# Altium project FPGA Interface Board.PrjPcb
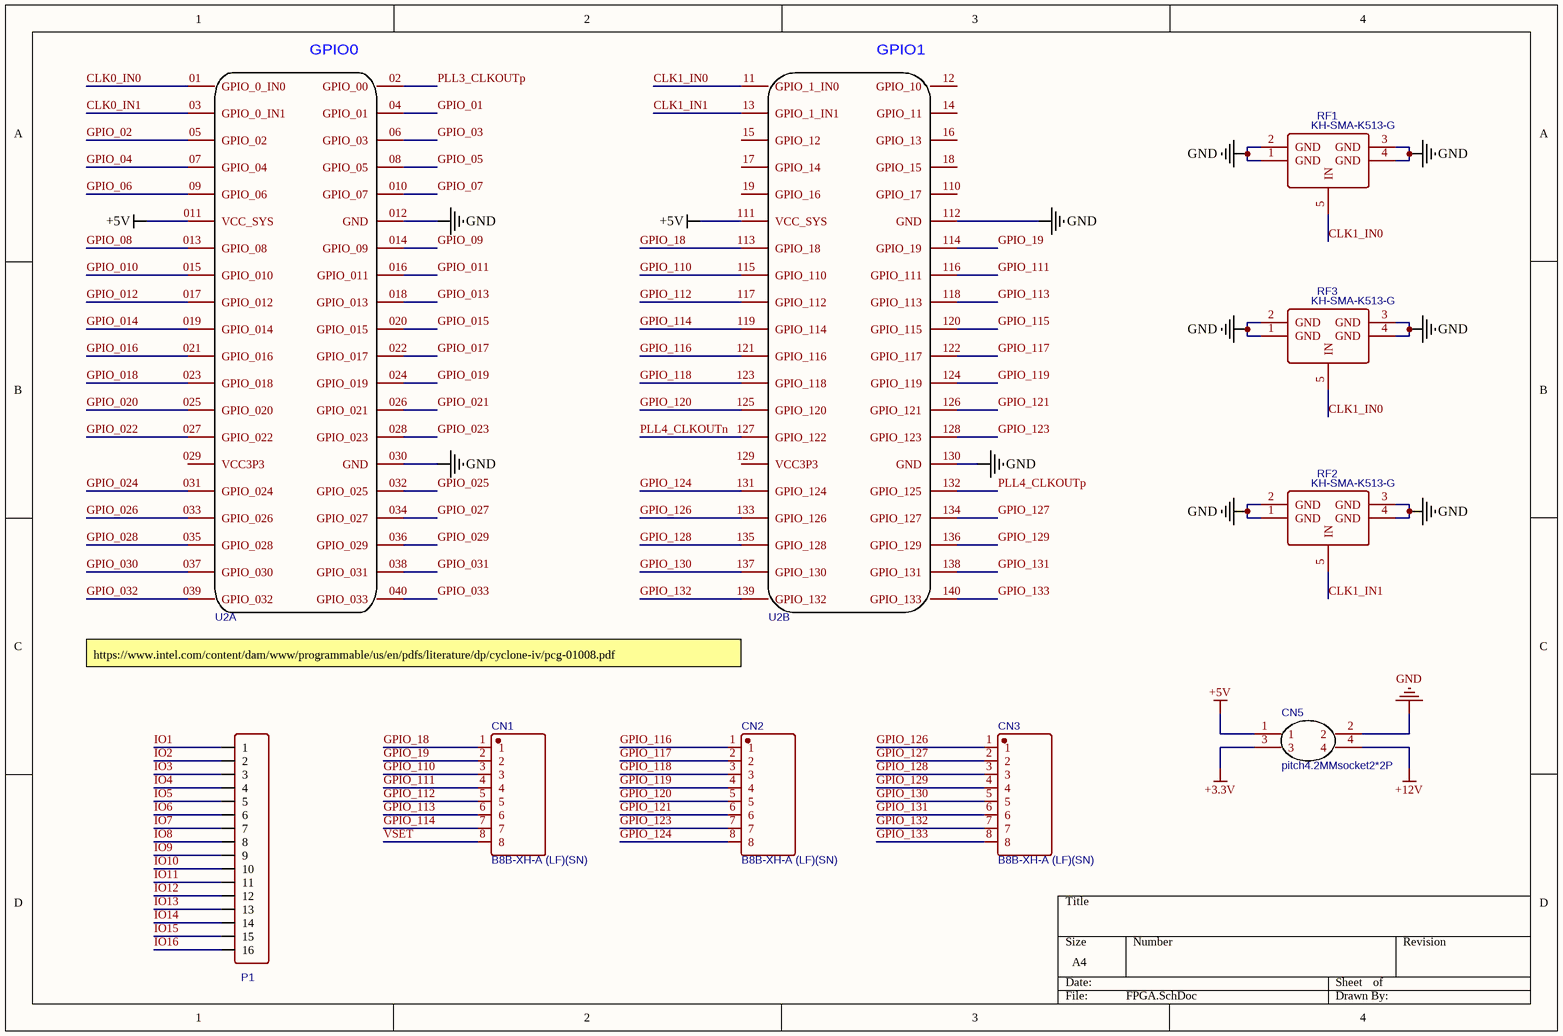
[diagram p0: FPGA.SchDoc]
5 sheets, 216 parts. Net scope: global (net labels, ports and power ports of the same name join across sheets).
Board file: PCB1.PcbDoc
Sheets:
  FPGA.SchDoc
  Shift Registers.SchDoc
  Level Translators.SchDoc
  Logic Voltage Source.SchDoc
  Level Translateor switches.SchDoc

## Sheet FPGA.SchDoc
size A4

### Parts
CN1  B8B-XH-A (LF)(SN)  [CONN-TH_B8B-XH-A (LF)(SN)]
CN2  B8B-XH-A (LF)(SN)  [CONN-TH_B8B-XH-A (LF)(SN)]
CN3  B8B-XH-A (LF)(SN)  [CONN-TH_B8B-XH-A (LF)(SN)]
CN5  pitch4.2MMsocket2*2P  [CONN-TH_HAA420A-4A]
P1  Header-Female-2.54_1x16  [HDR-TH_16P-P2.54-V]  (value not drawn)
RF1  KH-SMA-K513-G  [ANT-TH_KH-SMA-K513-G]
RF2  KH-SMA-K513-G  [ANT-TH_KH-SMA-K513-G]
RF3  KH-SMA-K513-G  [ANT-TH_KH-SMA-K513-G]
U2  DE0 NANO UPSIDE-DOWN PIN HEADERS COPY  [DE0-NANO UPSIDE DOWN]  (value not drawn)  (parts A,B of 2)

### Nets
+3.3V: CN5.3
+5V: CN5.1 U2.011(VCC_SYS) U2.111(VCC_SYS)
+12V: CN5.4
GND: CN5.2 RF1.1(GND) RF1.2(GND) RF1.3(GND) RF1.4(GND) RF2.1(GND) RF2.2(GND) RF2.3(GND) RF2.4(GND) RF3.1(GND) RF3.2(GND) RF3.3(GND) RF3.4(GND) U2.012(GND) U2.030(GND) U2.112(GND) U2.130(GND)
CLK0_IN0: U2.01(GPIO_0_IN0)
CLK0_IN1: U2.03(GPIO_0_IN1)
CLK1_IN0: RF1.5(IN) RF3.5(IN) U2.11(GPIO_1_IN0)
CLK1_IN1: RF2.5(IN) U2.13(GPIO_1_IN1)
GPIO_01: U2.04(GPIO_01)
GPIO_02: U2.05(GPIO_02)
GPIO_03: U2.06(GPIO_03)
GPIO_04: U2.07(GPIO_04)
GPIO_05: U2.08(GPIO_05)
GPIO_06: U2.09(GPIO_06)
GPIO_07: U2.010(GPIO_07)
GPIO_08: U2.013(GPIO_08)
GPIO_09: U2.014(GPIO_09)
GPIO_010: U2.015(GPIO_010)
GPIO_011: U2.016(GPIO_011)
GPIO_012: U2.017(GPIO_012)
GPIO_013: U2.018(GPIO_013)
GPIO_014: U2.019(GPIO_014)
GPIO_015: U2.020(GPIO_015)
GPIO_016: U2.021(GPIO_016)
GPIO_017: U2.022(GPIO_017)
GPIO_018: U2.023(GPIO_018)
GPIO_18: CN1.1 U2.113(GPIO_18)
GPIO_019: U2.024(GPIO_019)
GPIO_19: CN1.2 U2.114(GPIO_19)
GPIO_020: U2.025(GPIO_020)
GPIO_021: U2.026(GPIO_021)
GPIO_022: U2.027(GPIO_022)
GPIO_023: U2.028(GPIO_023)
GPIO_024: U2.031(GPIO_024)
GPIO_025: U2.032(GPIO_025)
GPIO_026: U2.033(GPIO_026)
GPIO_027: U2.034(GPIO_027)
GPIO_028: U2.035(GPIO_028)
GPIO_029: U2.036(GPIO_029)
GPIO_030: U2.037(GPIO_030)
GPIO_031: U2.038(GPIO_031)
GPIO_032: U2.039(GPIO_032)
GPIO_033: U2.040(GPIO_033)
GPIO_110: CN1.3 U2.115(GPIO_110)
GPIO_111: CN1.4 U2.116(GPIO_111)
GPIO_112: CN1.5 U2.117(GPIO_112)
GPIO_113: CN1.6 U2.118(GPIO_113)
GPIO_114: CN1.7 U2.119(GPIO_114)
GPIO_115: U2.120(GPIO_115)
GPIO_116: CN2.1 U2.121(GPIO_116)
GPIO_117: CN2.2 U2.122(GPIO_117)
GPIO_118: CN2.3 U2.123(GPIO_118)
GPIO_119: CN2.4 U2.124(GPIO_119)
GPIO_120: CN2.5 U2.125(GPIO_120)
GPIO_121: CN2.6 U2.126(GPIO_121)
GPIO_123: CN2.7 U2.128(GPIO_123)
GPIO_124: CN2.8 U2.131(GPIO_124)
GPIO_126: CN3.1 U2.133(GPIO_126)
GPIO_127: CN3.2 U2.134(GPIO_127)
GPIO_128: CN3.3 U2.135(GPIO_128)
GPIO_129: CN3.4 U2.136(GPIO_129)
GPIO_130: CN3.5 U2.137(GPIO_130)
GPIO_131: CN3.6 U2.138(GPIO_131)
GPIO_132: CN3.7 U2.139(GPIO_132)
GPIO_133: CN3.8 U2.140(GPIO_133)
IO1: P1.1
IO2: P1.2
IO3: P1.3
IO4: P1.4
IO5: P1.5
IO6: P1.6
IO7: P1.7
IO8: P1.8
IO9: P1.9
IO10: P1.10
IO11: P1.11
IO12: P1.12
IO13: P1.13
IO14: P1.14
IO15: P1.15
IO16: P1.16
PLL3_CLKOUTp: U2.02(GPIO_00)
PLL4_CLKOUTn: U2.127(GPIO_122)
PLL4_CLKOUTp: U2.132(GPIO_125)
VSET: CN1.8

Not connected (* = marked no-connect by the designer): U2 12(GPIO_10) 14(GPIO_11) 15(GPIO_12) 16(GPIO_13) 17(GPIO_14) 18(GPIO_15) 19(GPIO_16) 029(VCC3P3) 110(GPIO_17) 129(VCC3P3)

### Notes on the sheet
- (near U2) https://www.intel.com/content/dam/www/programmable/us/en/pdfs/literature/dp/cyclone-iv/pcg-01008.pdf
- (in symbol DE0 NANO UPSIDE-DOWN PIN HEADERS COPY, part A) GPIO0
- (in symbol DE0 NANO UPSIDE-DOWN PIN HEADERS COPY, part B) GPIO1

### Library data of the parts
CN1-CN3 = B8B-XH-A (LF)(SN): Manufacturer: JST Sales America; Contributor: LCSC; spicePre: C; spiceSymbolName: B8B-XH-A (LF)(SN); Supplier: LCSC; Supplier Part Number: C157972; Manufacture Part Number: B8B-XH-A (LF)(SN)
CN5 = pitch4.2MMsocket2*2P: Manufacturer: BOOMELE; image: //image.lceda.cn/szlcsc/C24697.jpg; spicePre: C; spiceSymbolName: pitch4.2MMsocket2*2P; Supplier: LCSC; Manufacture Part Number: pitch4.2MMsocket2*2P; Supplier Part Number: C24697
P1 = Header-Female-2.54_1x16: Manufacturer: BOOMELE; Manufacture Part Number: Female header1*16P pitch 2.54mm; image: //image.lceda.cn/szlcsc/C66987.jpg; spicePre: P; spiceSymbolName: Header-Female-2.54_1x16; Supplier: LCSC; Supplier Part Number: C66987
RF1-RF3 = KH-SMA-K513-G: Manufacturer: Shenzhen Kinghelm Elec; Contributor: LCSC; spicePre: R; spiceSymbolName: KH-SMA-K513-G; Supplier: LCSC; Supplier Part Number: C411575; Manufacture Part Number: KH-SMA-K513-G
U2 = DE0 NANO UPSIDE-DOWN PIN HEADERS COPY: subpart_no: 1; Contributor: cemasoniv; spicePre: U; spiceSymbolName: DE0 NANO UPSIDE-DOWN PIN HEADERS COPY

## Sheet Shift Registers.SchDoc
size A4
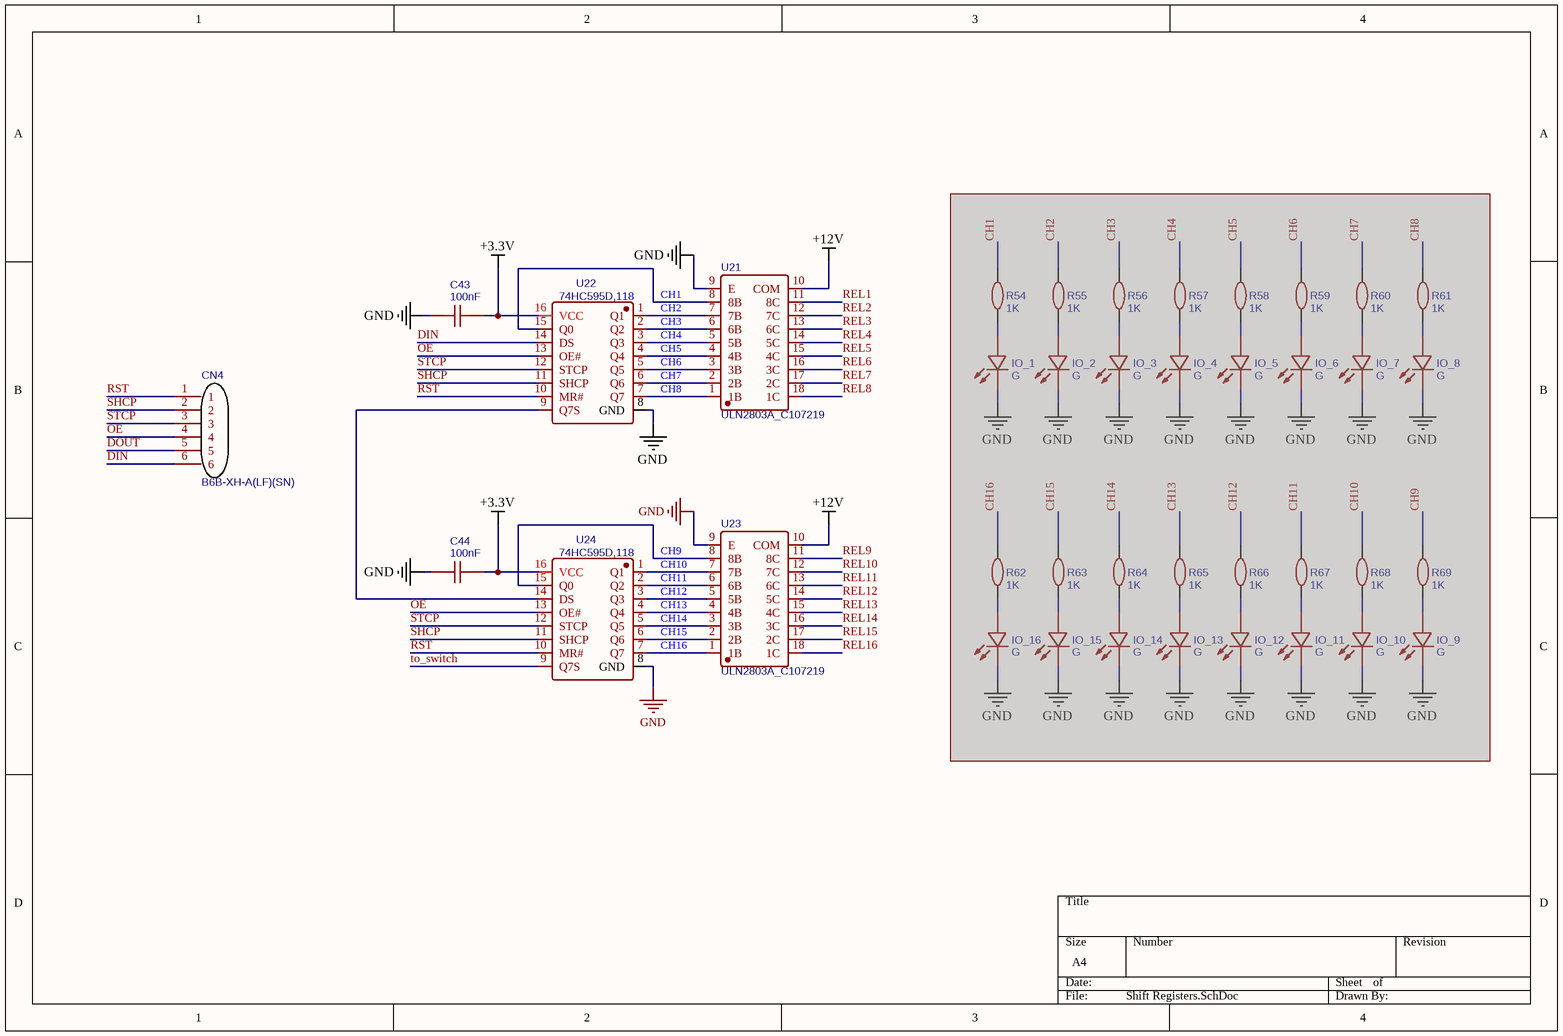
[diagram p1: Shift Registers.SchDoc]

### Parts
(Parts that share a designator on the sheet are numbered #1, #2 ... from top to bottom, then left to right.)
C43  100nF  [C0603]
C44  100nF  [C0603]
CN4  B6B-XH-A(LF)(SN)  [CONN-TH_6P-P2.50_B6B-XH-A(LF)(SN)]
IO_1  G  [LED0603-R-RD]  (masked out: inside a compile mask, not in the netlist)
IO_2  G  [LED0603-R-RD]  (masked out: inside a compile mask, not in the netlist)
IO_3  G  [LED0603-R-RD]  (masked out: inside a compile mask, not in the netlist)
IO_4  G  [LED0603-R-RD]  (masked out: inside a compile mask, not in the netlist)
IO_5  G  [LED0603-R-RD]  (masked out: inside a compile mask, not in the netlist)
IO_6  G  [LED0603-R-RD]  (masked out: inside a compile mask, not in the netlist)
IO_7  G  [LED0603-R-RD]  (masked out: inside a compile mask, not in the netlist)
IO_8  G  [LED0603-R-RD]  (masked out: inside a compile mask, not in the netlist)
IO_9  G  [LED0603-R-RD]  (masked out: inside a compile mask, not in the netlist)
IO_10  G  [LED0603-R-RD]  (masked out: inside a compile mask, not in the netlist)
IO_11  G  [LED0603-R-RD]  (masked out: inside a compile mask, not in the netlist)
IO_12  G  [LED0603-R-RD]  (masked out: inside a compile mask, not in the netlist)
IO_13  G  [LED0603-R-RD]  (masked out: inside a compile mask, not in the netlist)
IO_14  G  [LED0603-R-RD]  (masked out: inside a compile mask, not in the netlist)
IO_15  G  [LED0603-R-RD]  (masked out: inside a compile mask, not in the netlist)
IO_16  G  [LED0603-R-RD]  (masked out: inside a compile mask, not in the netlist)
R54#1  1K  [R0603]  (masked out: inside a compile mask, not in the netlist)
R55#1  1K  [R0603]  (masked out: inside a compile mask, not in the netlist)
R56#1  1K  [R0603]  (masked out: inside a compile mask, not in the netlist)
R57#1  1K  [R0603]  (masked out: inside a compile mask, not in the netlist)
R58#1  1K  [R0603]  (masked out: inside a compile mask, not in the netlist)
R59#1  1K  [R0603]  (masked out: inside a compile mask, not in the netlist)
R60#1  1K  [R0603]  (masked out: inside a compile mask, not in the netlist)
R61#1  1K  [R0603]  (masked out: inside a compile mask, not in the netlist)
R62#1  1K  [R0603]  (masked out: inside a compile mask, not in the netlist)
R63#1  1K  [R0603]  (masked out: inside a compile mask, not in the netlist)
R64#1  1K  [R0603]  (masked out: inside a compile mask, not in the netlist)
R65#1  1K  [R0603]  (masked out: inside a compile mask, not in the netlist)
R66#1  1K  [R0603]  (masked out: inside a compile mask, not in the netlist)
R67#1  1K  [R0603]  (masked out: inside a compile mask, not in the netlist)
R68#1  1K  [R0603]  (masked out: inside a compile mask, not in the netlist)
R69#1  1K  [R0603]  (masked out: inside a compile mask, not in the netlist)
U21  ULN2803A_C107219  [SOP-18_L11.4-W7.6-P1.27-LS10.6-BL]
U22  74HC595D,118  [SOIC-16_L9.9-W3.9-P1.27-LS6.0-BL]
U23  ULN2803A_C107219  [SOP-18_L11.4-W7.6-P1.27-LS10.6-BL]
U24  74HC595D,118  [SOIC-16_L9.9-W3.9-P1.27-LS6.0-BL]

### Nets
+3.3V: C43.2 C44.2 U22.16(VCC) U24.16(VCC)
+12V: U21.10(COM) U23.10(COM)
GND: C43.1 C44.1 U21.9(E) U22.8(GND) U23.9(E) U24.8(GND)
CH1: U21.8(8B) U22.15(Q0)
CH2: U21.7(7B) U22.1(Q1)
CH3: U21.6(6B) U22.2(Q2)
CH4: U21.5(5B) U22.3(Q3)
CH5: U21.4(4B) U22.4(Q4)
CH6: U21.3(3B) U22.5(Q5)
CH7: U21.2(2B) U22.6(Q6)
CH8: U21.1(1B) U22.7(Q7)
CH9: U23.8(8B) U24.15(Q0)
CH10: U23.7(7B) U24.1(Q1)
CH11: U23.6(6B) U24.2(Q2)
CH12: U23.5(5B) U24.3(Q3)
CH13: U23.4(4B) U24.4(Q4)
CH14: U23.3(3B) U24.5(Q5)
CH15: U23.2(2B) U24.6(Q6)
CH16: U23.1(1B) U24.7(Q7)
DIN: CN4.6 U22.14(DS)
DOUT: CN4.5
OE: CN4.4 U22.13(OE#) U24.13(OE#)
REL1: U21.11(8C)
REL2: U21.12(7C)
REL3: U21.13(6C)
REL4: U21.14(5C)
REL5: U21.15(4C)
REL6: U21.16(3C)
REL7: U21.17(2C)
REL8: U21.18(1C)
REL9: U23.11(8C)
REL10: U23.12(7C)
REL11: U23.13(6C)
REL12: U23.14(5C)
REL13: U23.15(4C)
REL14: U23.16(3C)
REL15: U23.17(2C)
REL16: U23.18(1C)
RST: CN4.1 U22.10(MR#) U24.10(MR#)
SHCP: CN4.2 U22.11(SHCP) U24.11(SHCP)
STCP: CN4.3 U22.12(STCP) U24.12(STCP)
to_switch: U24.9(Q7S)
NetU22_9: U22.9(Q7S) U24.14(DS)

### Library data of the parts
C43 C44 = 100nF: Manufacturer: YAGEO; Manufacture Part Number: CC0603KRX7R9BB104; nameAlias: Capacitance; SMT Type: Basic; BOM_LCSC Assembly: Yes; spicePre: C; spiceSymbolName: CC0603KRX7R9BB104; Supplier: LCSC; Supplier Part Number: C14663
CN4 = B6B-XH-A(LF)(SN): Manufacturer: JST Sales America; Contributor: LCSC; spicePre: U; spiceSymbolName: B6B-XH-A(LF)(SN); Supplier: LCSC; Supplier Part Number: C144397; Manufacture Part Number: B6B-XH-A(LF)(SN)
IO_1-IO_16 = G: Manufacturer: Orient; Manufacture Part Number: ORH-G36G; Contributor: LCSC; SMT Type: Extend; BOM_LCSC Assembly: Yes; spicePre: L; spiceSymbolName: ORH-G36G; Supplier: LCSC; Supplier Part Number: C205443
R54#1 R55#1 R56#1 R57#1 R58#1 R59#1 R60#1 R61#1 R62#1 R63#1 R64#1 R65#1 R66#1 R67#1 R68#1 R69#1 = 1K: Manufacture Part Number: RC0603FR-071KL; Manufacturer: YAGEO; nameAlias: Resistance (Ohms); spicePre: R; spiceSymbolName: RC0603FR-071KL; Supplier: LCSC; Supplier Part Number: C22548
U21 U23 = ULN2803A_C107219: Manufacturer: MIXIC; SMT Type: Extend; BOM_LCSC Assembly: Yes; spicePre: U; spiceSymbolName: ULN2803A_C107219; Supplier: LCSC; Manufacture Part Number: ULN2803A; Supplier Part Number: C107219
U22 U24 = 74HC595D,118: Manufacturer: Nexperia; SMT Type: Basic; spicePre: X; BOM_LCSC Assembly: Yes; image: //image.lceda.cn/szlcsc/C5947.jpg; spiceSymbolName: 74HC595D,118; Supplier: LCSC; Manufacture Part Number: 74HC595D,118; Supplier Part Number: C5947

## Sheet Level Translators.SchDoc
size A2
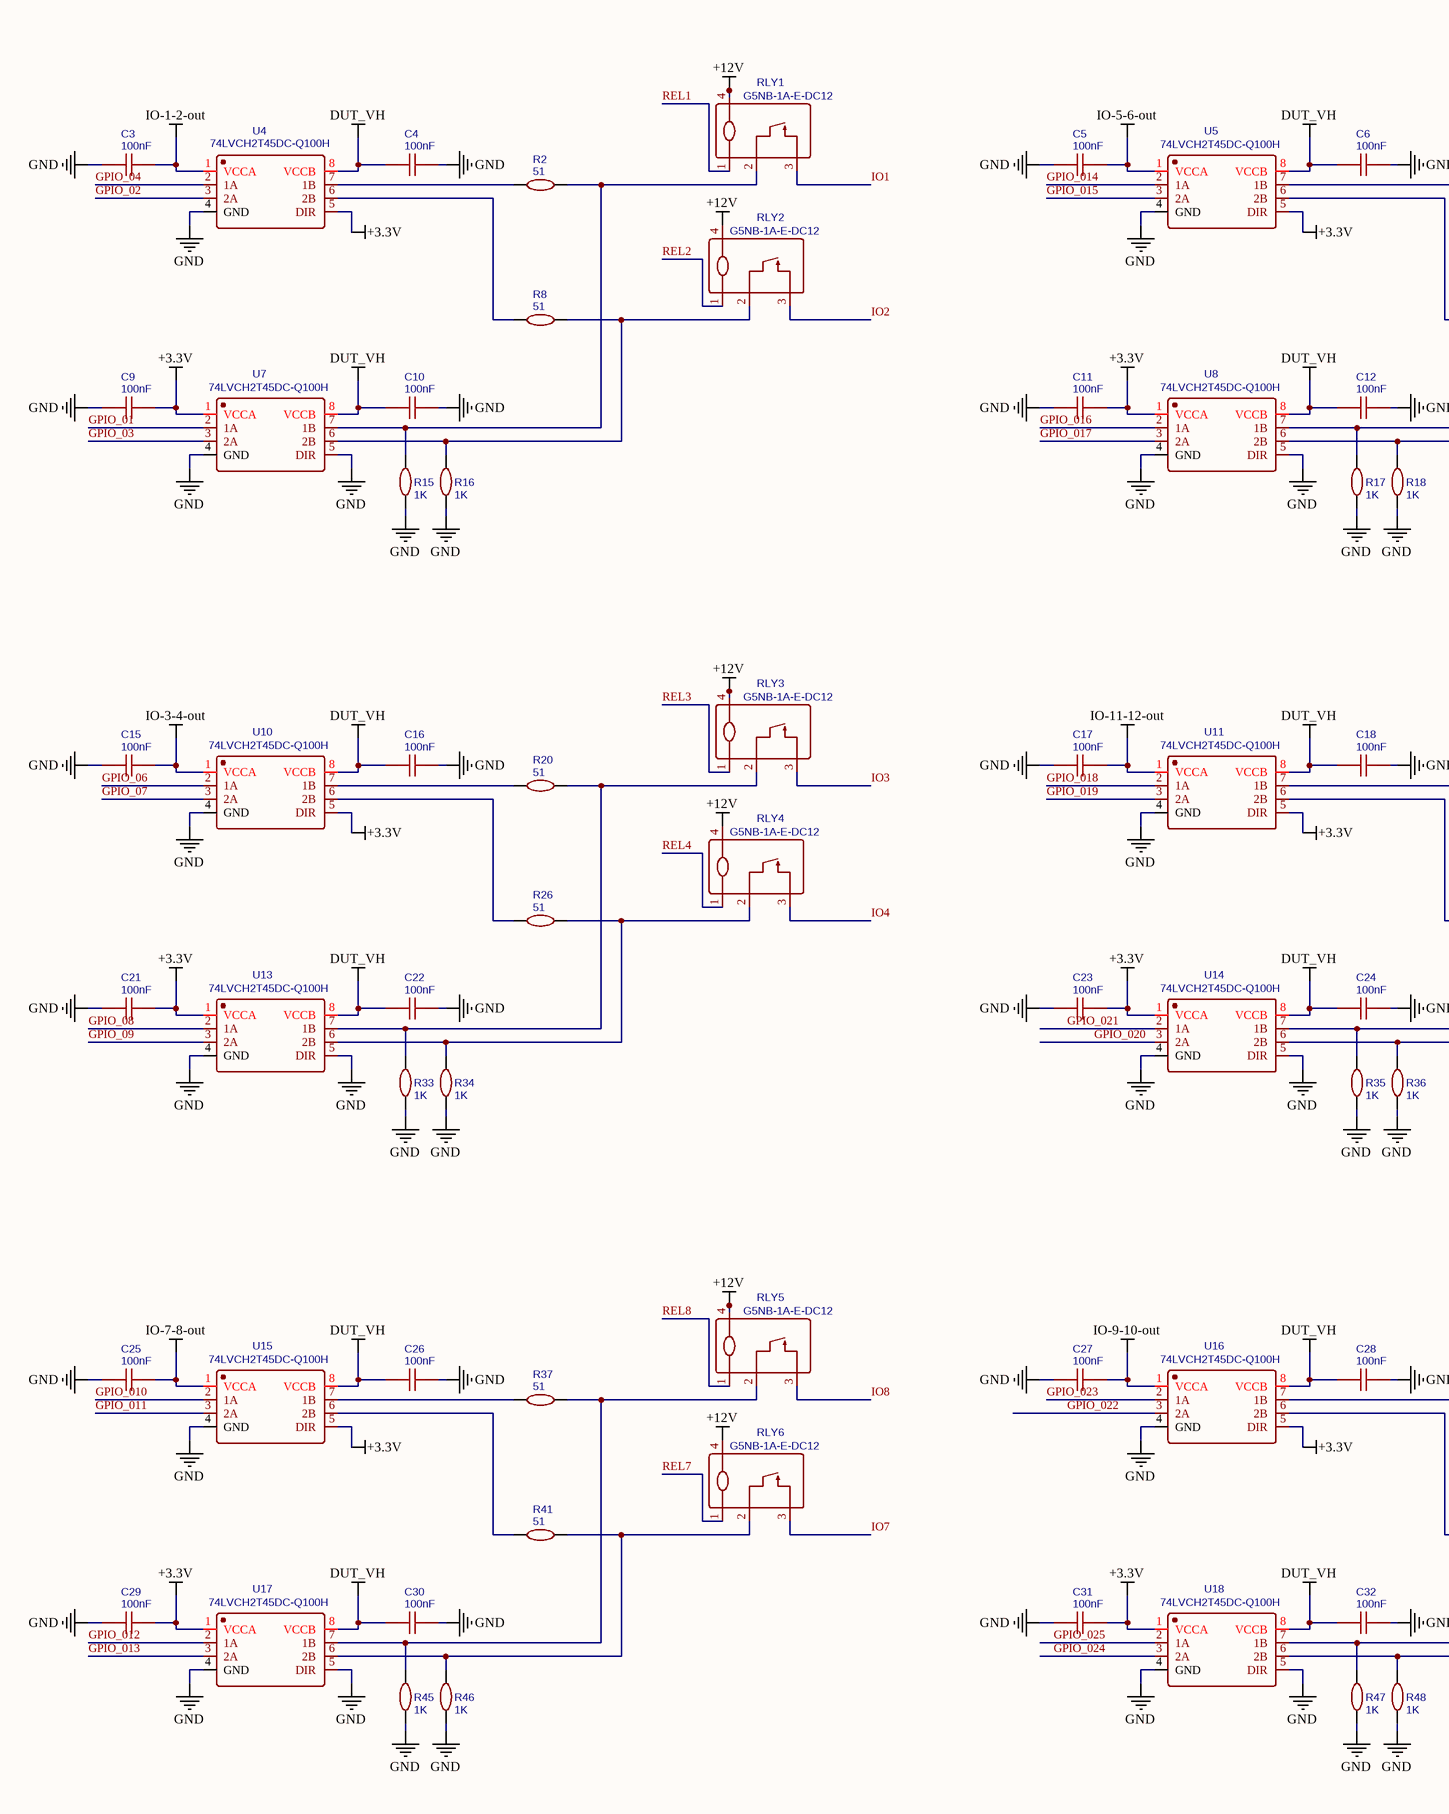
[diagram p2: Level Translators.SchDoc, left]
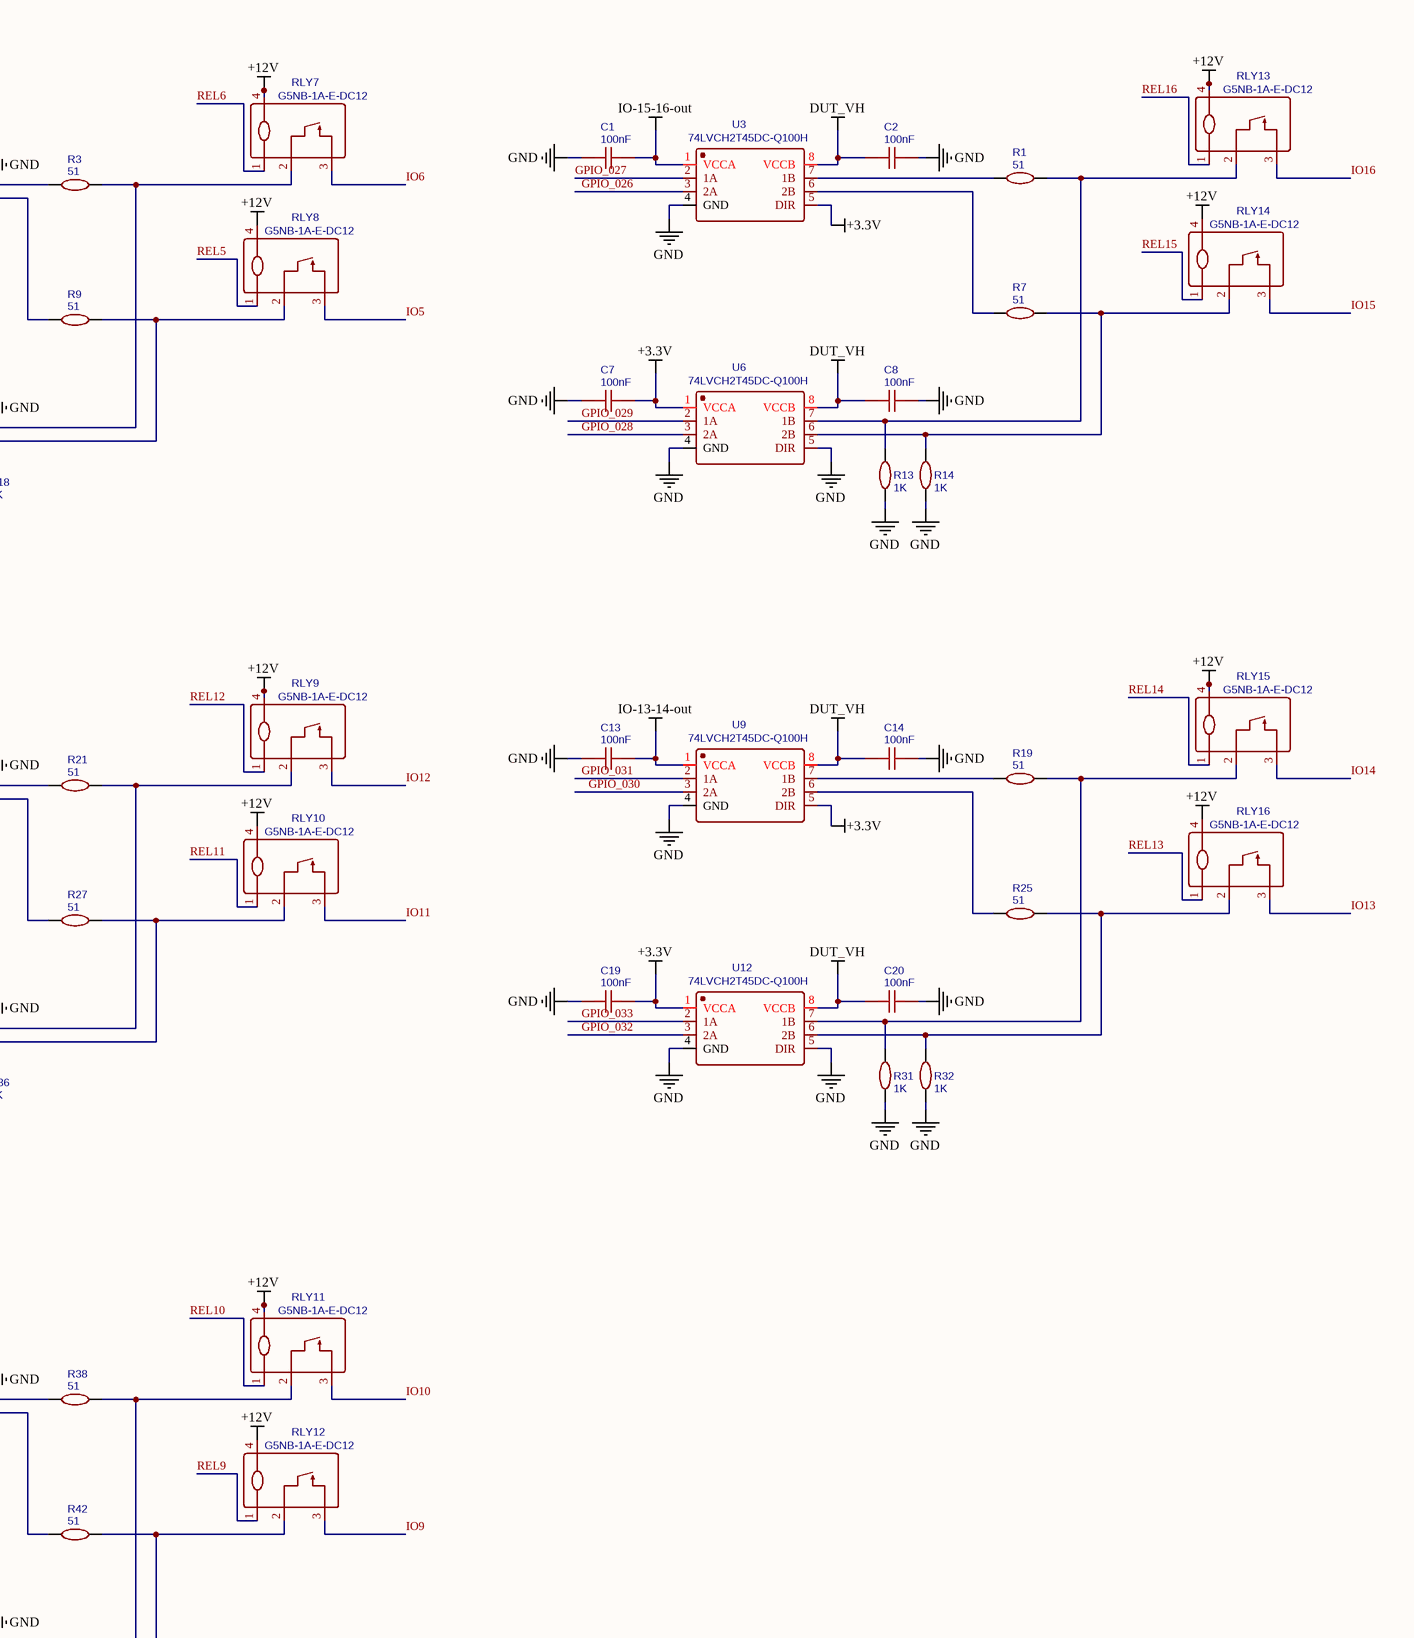
[diagram p3: Level Translators.SchDoc, right]

### Parts
C1  100nF  [C0603]
C2  100nF  [C0603]
C3  100nF  [C0603]
C4  100nF  [C0603]
C5  100nF  [C0603]
C6  100nF  [C0603]
C7  100nF  [C0603]
C8  100nF  [C0603]
C9  100nF  [C0603]
C10  100nF  [C0603]
C11  100nF  [C0603]
C12  100nF  [C0603]
C13  100nF  [C0603]
C14  100nF  [C0603]
C15  100nF  [C0603]
C16  100nF  [C0603]
C17  100nF  [C0603]
C18  100nF  [C0603]
C19  100nF  [C0603]
C20  100nF  [C0603]
C21  100nF  [C0603]
C22  100nF  [C0603]
C23  100nF  [C0603]
C24  100nF  [C0603]
C25  100nF  [C0603]
C26  100nF  [C0603]
C27  100nF  [C0603]
C28  100nF  [C0603]
C29  100nF  [C0603]
C30  100nF  [C0603]
C31  100nF  [C0603]
C32  100nF  [C0603]
R1  51  [R0603]
R2  51  [R0603]
R3  51  [R0603]
R7  51  [R0603]
R8  51  [R0603]
R9  51  [R0603]
R13  1K  [R0603]
R14  1K  [R0603]
R15  1K  [R0603]
R16  1K  [R0603]
R17  1K  [R0603]
R18  1K  [R0603]
R19  51  [R0603]
R20  51  [R0603]
R21  51  [R0603]
R25  51  [R0603]
R26  51  [R0603]
R27  51  [R0603]
R31  1K  [R0603]
R32  1K  [R0603]
R33  1K  [R0603]
R34  1K  [R0603]
R35  1K  [R0603]
R36  1K  [R0603]
R37  51  [R0603]
R38  51  [R0603]
R41  51  [R0603]
R42  51  [R0603]
R45  1K  [R0603]
R46  1K  [R0603]
R47  1K  [R0603]
R48  1K  [R0603]
RLY1  G5NB-1A-E-DC12  [RELAY-TH_G5NB-1A-E-DCXX]
RLY2  G5NB-1A-E-DC12  [RELAY-TH_G5NB-1A-E-DCXX]
RLY3  G5NB-1A-E-DC12  [RELAY-TH_G5NB-1A-E-DCXX]
RLY4  G5NB-1A-E-DC12  [RELAY-TH_G5NB-1A-E-DCXX]
RLY5  G5NB-1A-E-DC12  [RELAY-TH_G5NB-1A-E-DCXX]
RLY6  G5NB-1A-E-DC12  [RELAY-TH_G5NB-1A-E-DCXX]
RLY7  G5NB-1A-E-DC12  [RELAY-TH_G5NB-1A-E-DCXX]
RLY8  G5NB-1A-E-DC12  [RELAY-TH_G5NB-1A-E-DCXX]
RLY9  G5NB-1A-E-DC12  [RELAY-TH_G5NB-1A-E-DCXX]
RLY10  G5NB-1A-E-DC12  [RELAY-TH_G5NB-1A-E-DCXX]
RLY11  G5NB-1A-E-DC12  [RELAY-TH_G5NB-1A-E-DCXX]
RLY12  G5NB-1A-E-DC12  [RELAY-TH_G5NB-1A-E-DCXX]
RLY13  G5NB-1A-E-DC12  [RELAY-TH_G5NB-1A-E-DCXX]
RLY14  G5NB-1A-E-DC12  [RELAY-TH_G5NB-1A-E-DCXX]
RLY15  G5NB-1A-E-DC12  [RELAY-TH_G5NB-1A-E-DCXX]
RLY16  G5NB-1A-E-DC12  [RELAY-TH_G5NB-1A-E-DCXX]
U3  74LVCH2T45DC-Q100H  [VSSOP-8_L2.4-W2.1-P0.50-LS3.2-BR]
U4  74LVCH2T45DC-Q100H  [VSSOP-8_L2.4-W2.1-P0.50-LS3.2-BR]
U5  74LVCH2T45DC-Q100H  [VSSOP-8_L2.4-W2.1-P0.50-LS3.2-BR]
U6  74LVCH2T45DC-Q100H  [VSSOP-8_L2.4-W2.1-P0.50-LS3.2-BR]
U7  74LVCH2T45DC-Q100H  [VSSOP-8_L2.4-W2.1-P0.50-LS3.2-BR]
U8  74LVCH2T45DC-Q100H  [VSSOP-8_L2.4-W2.1-P0.50-LS3.2-BR]
U9  74LVCH2T45DC-Q100H  [VSSOP-8_L2.4-W2.1-P0.50-LS3.2-BR]
U10  74LVCH2T45DC-Q100H  [VSSOP-8_L2.4-W2.1-P0.50-LS3.2-BR]
U11  74LVCH2T45DC-Q100H  [VSSOP-8_L2.4-W2.1-P0.50-LS3.2-BR]
U12  74LVCH2T45DC-Q100H  [VSSOP-8_L2.4-W2.1-P0.50-LS3.2-BR]
U13  74LVCH2T45DC-Q100H  [VSSOP-8_L2.4-W2.1-P0.50-LS3.2-BR]
U14  74LVCH2T45DC-Q100H  [VSSOP-8_L2.4-W2.1-P0.50-LS3.2-BR]
U15  74LVCH2T45DC-Q100H  [VSSOP-8_L2.4-W2.1-P0.50-LS3.2-BR]
U16  74LVCH2T45DC-Q100H  [VSSOP-8_L2.4-W2.1-P0.50-LS3.2-BR]
U17  74LVCH2T45DC-Q100H  [VSSOP-8_L2.4-W2.1-P0.50-LS3.2-BR]
U18  74LVCH2T45DC-Q100H  [VSSOP-8_L2.4-W2.1-P0.50-LS3.2-BR]

### Nets
+3.3V: C7.2 C9.2 C11.2 C19.2 C21.2 C23.2 C29.2 C31.2 U3.5(DIR) U4.5(DIR) U5.5(DIR) U6.1(VCCA) U7.1(VCCA) U8.1(VCCA) U9.5(DIR) U10.5(DIR) U11.5(DIR) U12.1(VCCA) U13.1(VCCA) U14.1(VCCA) U15.5(DIR) U16.5(DIR) U17.1(VCCA) U18.1(VCCA)
+12V: RLY1.4 RLY2.4 RLY3.4 RLY4.4 RLY5.4 RLY6.4 RLY7.4 RLY8.4 RLY9.4 RLY10.4 RLY11.4 RLY12.4 RLY13.4 RLY14.4 RLY15.4 RLY16.4
DUT_VH: C2.1 C4.1 C6.1 C8.1 C10.1 C12.1 C14.1 C16.1 C18.1 C20.1 C22.1 C24.1 C26.1 C28.1 C30.1 C32.1 U3.8(VCCB) U4.8(VCCB) U5.8(VCCB) U6.8(VCCB) U7.8(VCCB) U8.8(VCCB) U9.8(VCCB) U10.8(VCCB) U11.8(VCCB) U12.8(VCCB) U13.8(VCCB) U14.8(VCCB) U15.8(VCCB) U16.8(VCCB) U17.8(VCCB) U18.8(VCCB)
GND: C1.1 C2.2 C3.1 C4.2 C5.1 C6.2 C7.1 C8.2 C9.1 C10.2 C11.1 C12.2 C13.1 C14.2 C15.1 C16.2 C17.1 C18.2 C19.1 C20.2 C21.1 C22.2 C23.1 C24.2 C25.1 C26.2 C27.1 C28.2 C29.1 C30.2 C31.1 C32.2 R13.1 R14.1 R15.1 R16.1 R17.1 R18.1 R31.1 R32.1 R33.1 R34.1 R35.1 R36.1 R45.1 R46.1 R47.1 R48.1 U3.4(GND) U4.4(GND) U5.4(GND) U6.4(GND) U6.5(DIR) U7.4(GND) U7.5(DIR) U8.4(GND) U8.5(DIR) U9.4(GND) U10.4(GND) U11.4(GND) U12.4(GND) U12.5(DIR) U13.4(GND) U13.5(DIR) U14.4(GND) U14.5(DIR) U15.4(GND) U16.4(GND) U17.4(GND) U17.5(DIR) U18.4(GND) U18.5(DIR)
IO-1-2-out: C3.2 U4.1(VCCA)
IO-3-4-out: C15.2 U10.1(VCCA)
IO-5-6-out: C5.2 U5.1(VCCA)
IO-7-8-out: C25.2 U15.1(VCCA)
IO-9-10-out: C27.2 U16.1(VCCA)
IO-11-12-out: C17.2 U11.1(VCCA)
IO-13-14-out: C13.2 U9.1(VCCA)
IO-15-16-out: C1.2 U3.1(VCCA)
GPIO_01: U7.2(1A)
GPIO_02: U4.3(2A)
GPIO_03: U7.3(2A)
GPIO_04: U4.2(1A)
GPIO_06: U10.2(1A)
GPIO_07: U10.3(2A)
GPIO_08: U13.2(1A)
GPIO_09: U13.3(2A)
GPIO_010: U15.2(1A)
GPIO_011: U15.3(2A)
GPIO_012: U17.2(1A)
GPIO_013: U17.3(2A)
GPIO_014: U5.2(1A)
GPIO_015: U5.3(2A)
GPIO_016: U8.2(1A)
GPIO_017: U8.3(2A)
GPIO_018: U11.2(1A)
GPIO_019: U11.3(2A)
GPIO_020: U14.3(2A)
GPIO_021: U14.2(1A)
GPIO_022: U16.3(2A)
GPIO_023: U16.2(1A)
GPIO_024: U18.3(2A)
GPIO_025: U18.2(1A)
GPIO_026: U3.3(2A)
GPIO_027: U3.2(1A)
GPIO_028: U6.3(2A)
GPIO_029: U6.2(1A)
GPIO_030: U9.3(2A)
GPIO_031: U9.2(1A)
GPIO_032: U12.3(2A)
GPIO_033: U12.2(1A)
IO1: RLY1.3
IO2: RLY2.3
IO3: RLY3.3
IO4: RLY4.3
IO5: RLY8.3
IO6: RLY7.3
IO7: RLY6.3
IO8: RLY5.3
IO9: RLY12.3
IO10: RLY11.3
IO11: RLY10.3
IO12: RLY9.3
IO13: RLY16.3
IO14: RLY15.3
IO15: RLY14.3
IO16: RLY13.3
REL1: RLY1.1
REL2: RLY2.1
REL3: RLY3.1
REL4: RLY4.1
REL5: RLY8.1
REL6: RLY7.1
REL7: RLY6.1
REL8: RLY5.1
REL9: RLY12.1
REL10: RLY11.1
REL11: RLY10.1
REL12: RLY9.1
REL13: RLY16.1
REL14: RLY15.1
REL15: RLY14.1
REL16: RLY13.1
NetR1_1: R1.1 U3.7(1B)
NetR1_2: R1.2 R13.2 RLY13.2 U6.7(1B)
NetR2_1: R2.1 U4.7(1B)
NetR2_2: R2.2 R15.2 RLY1.2 U7.7(1B)
NetR3_1: R3.1 U5.7(1B)
NetR3_2: R3.2 R17.2 RLY7.2 U8.7(1B)
NetR7_1: R7.1 U3.6(2B)
NetR7_2: R7.2 R14.2 RLY14.2 U6.6(2B)
NetR8_1: R8.1 U4.6(2B)
NetR8_2: R8.2 R16.2 RLY2.2 U7.6(2B)
NetR9_1: R9.1 U5.6(2B)
NetR9_2: R9.2 R18.2 RLY8.2 U8.6(2B)
NetR19_1: R19.1 U9.7(1B)
NetR19_2: R19.2 R31.2 RLY15.2 U12.7(1B)
NetR20_1: R20.1 U10.7(1B)
NetR20_2: R20.2 R33.2 RLY3.2 U13.7(1B)
NetR21_1: R21.1 U11.7(1B)
NetR21_2: R21.2 R35.2 RLY9.2 U14.7(1B)
NetR25_1: R25.1 U9.6(2B)
NetR25_2: R25.2 R32.2 RLY16.2 U12.6(2B)
NetR26_1: R26.1 U10.6(2B)
NetR26_2: R26.2 R34.2 RLY4.2 U13.6(2B)
NetR27_1: R27.1 U11.6(2B)
NetR27_2: R27.2 R36.2 RLY10.2 U14.6(2B)
NetR37_1: R37.1 U15.7(1B)
NetR37_2: R37.2 R45.2 RLY5.2 U17.7(1B)
NetR38_1: R38.1 U16.7(1B)
NetR38_2: R38.2 R47.2 RLY11.2 U18.7(1B)
NetR41_1: R41.1 U15.6(2B)
NetR41_2: R41.2 R46.2 RLY6.2 U17.6(2B)
NetR42_1: R42.1 U16.6(2B)
NetR42_2: R42.2 R48.2 RLY12.2 U18.6(2B)

### Library data of the parts
C1-C32 = 100nF: as C43 on sheet Shift Registers; BOM_LCSC Assembly: Yes; spicePre: C; spiceSymbolName: CC0603KRX7R9BB104; Supplier: LCSC; Supplier Part Number: C14663
R1-R3 R7-R9 R19-R21 R25-R27 R37 R38 R41 R42 = 51: Manufacturer: UniOhm; Manufacture Part Number: 0603WAF510JT5E; nameAlias: Resistance (Ohms); SMT Type: Basic; BOM_LCSC Assembly: Yes; spicePre: R; spiceSymbolName: 0603WAF510JT5E; Supplier: LCSC; Supplier Part Number: C23197
R13-R18 R31-R36 R45-R48 = 1K: as R54#1 on sheet Shift Registers; spicePre: R; spiceSymbolName: RC0603FR-071KL; Supplier: LCSC; Supplier Part Number: C22548
RLY1-RLY16 = G5NB-1A-E-DC12: Manufacturer: Omron Electronics; Contributor: LCSC; spicePre: R; spiceSymbolName: G5NB-1A-E-DC12; Supplier: LCSC; Supplier Part Number: C225714; Manufacture Part Number: G5NB-1A-E-DC12
U3-U18 = 74LVCH2T45DC-Q100H: Manufacturer: Nexperia; Contributor: LCSC; SMT Type: Extend; BOM_LCSC Assembly: Yes; spicePre: U; spiceSymbolName: 74LVCH2T45DC-Q100H; Supplier: LCSC; Manufacture Part Number: 74LVCH2T45DC-Q100H; Supplier Part Number: C116382

## Sheet Logic Voltage Source.SchDoc
size A4
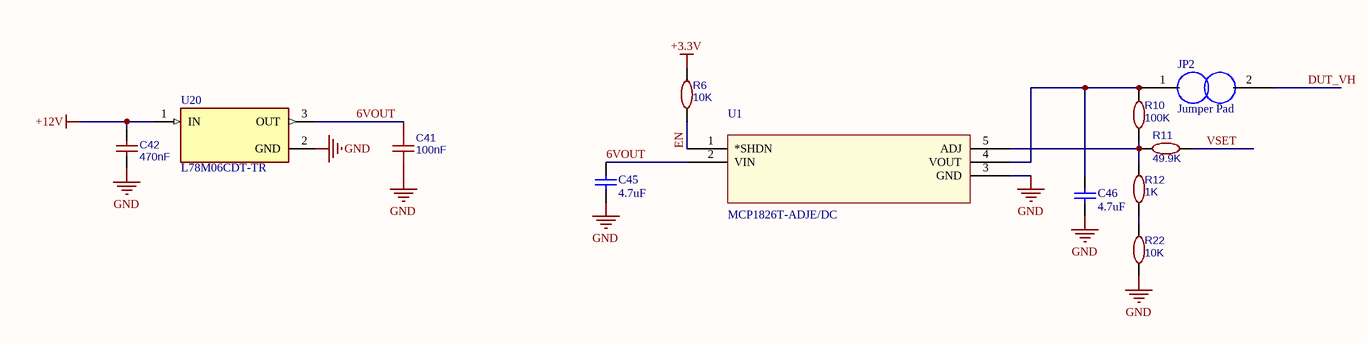
[diagram p4: Logic Voltage Source.SchDoc]

### Parts
C41  100nF  [C0603]
C42  470nF  [C0603]
C45  4.7uF  [CAPC1608X09N]
C46  4.7uF  [CAPC1608X09N]
JP2  Jumper Pad  [PCB-sjva3kmaxrqfkswkvsp7-1]
R6  10K  [R0603]
R10  100K  [R0603]
R11  49.9K  [R0603]
R12  1K  [R0603]
R22  10K  [R0603]
U1  MCP1826T-ADJE/DC  [MCP1826T-ADJE/DC]
U20  L78M06CDT-TR  [VREG_L78M06CDT-TR]

### Nets
+3.3V: R6.2
+12V: C42.2 U20.1(IN)
DUT_VH: JP2.2
GND: C41.1 C42.1 C45.1 C46.1 R22.1 U1.3(GND) U20.2(GND)
6VOUT: C41.2 C45.2 U1.2(VIN) U20.3(OUT)
EN: R6.1 U1.1(*SHDN)
VSET: R11.2
NetC46_2: C46.2 JP2.1 R10.2 U1.4(VOUT)
NetR10_1: R10.1 R11.1 R12.2 U1.5(ADJ)
NetR12_1: R12.1 R22.2

### Library data of the parts
C41 = 100nF: as C43 on sheet Shift Registers; BOM_LCSC Assembly: Yes; spicePre: C; spiceSymbolName: CC0603KRX7R9BB104; Supplier: LCSC; Supplier Part Number: C14663
C42 = 470nF: Manufacturer: WTC; Manufacture Part Number: 0603B474K100; nameAlias: Capacitance; Contributor: LCSC; Supplier: LCSC; Supplier Part Number: C123513; spicePre: C; spiceSymbolName: 0603B474K100
C45 C46 = CMP-2f55e5122ad9f092-5_3: 0603 10 nF 50 V ± 10% Tolerance X7R Surface Mount Multilayer Ceramic Capacitor; Manufacture Part Number: CL10A475KP8NNNC; Manufacturer: Samsung Electro-Mechanics; Voltage-Rated: 10V; Capacitance: 4.7uF; Package / Case: 0603; Supplier: LCSC; Supplier Part Number: C1705; Capacitance Tolerance: 10%
JP2 = CMP-75tq5o8j4p0avfd6ylbk-1: JP; CustomComponentID: 75tq5o8j4p0avfd6ylbk
R6 R22 = 10K: Manufacturer: YAGEO; Manufacture Part Number: RC0603FR-0710KL; nameAlias: Resistance (Ohms); spicePre: R; spiceSymbolName: RC0603FR-0710KL; Supplier: LCSC; Supplier Part Number: C98220
R10 = 100K: Manufacturer: UniOhm; Manufacture Part Number: 0603WAF1003T5E; nameAlias: Resistance (Ohms); SMT Type: Basic; Supplier: LCSC; BOM_LCSC Assembly: Yes; Supplier Part Number: C25803; spicePre: R; spiceSymbolName: 0603WAF1003T5E
R11 = 49.9K: Manufacturer: UniOhm; Manufacture Part Number: 0603WAF4992T5E; nameAlias: Resistance (Ohms); SMT Type: Basic; Supplier: LCSC; BOM_LCSC Assembly: Yes; Supplier Part Number: C23184; spicePre: R; spiceSymbolName: 0603WAF4992T5E
R12 = 1K: as R54#1 on sheet Shift Registers; spicePre: R; spiceSymbolName: RC0603FR-071KL; Supplier: LCSC; Supplier Part Number: C22548
U1 = MCP1826T-ADJE/DC: Adjustable 6V 0.8V ~ 5V 400mV @ 1A SOT-223-6 Dropout Regulators(LDO) RoHS; Manufacturer: Microchip Tech; Manufacture Part Number: MCP1826T-ADJE/DC; Supplier Part Number: C147898; Supplier: LCSC
U20 = L78M06CDT-TR: Linear Voltage Regulator IC 1 Output 500mA DPAK; Manufacturer: STMicroelectronics; Manufacture Part Number: L78M06CDT-TR; Price: None; Availability: Unavailable; SnapEDA_Link: https://www.snapeda.com/parts/L78M06CDT-TR/STMicroelectronics/view-part/276899/?ref=snap; Package: TO-252 STMicroelectronics; Supplier: LCSC; Supplier Part Number: C157444

## Sheet Level Translateor switches.SchDoc
size A3
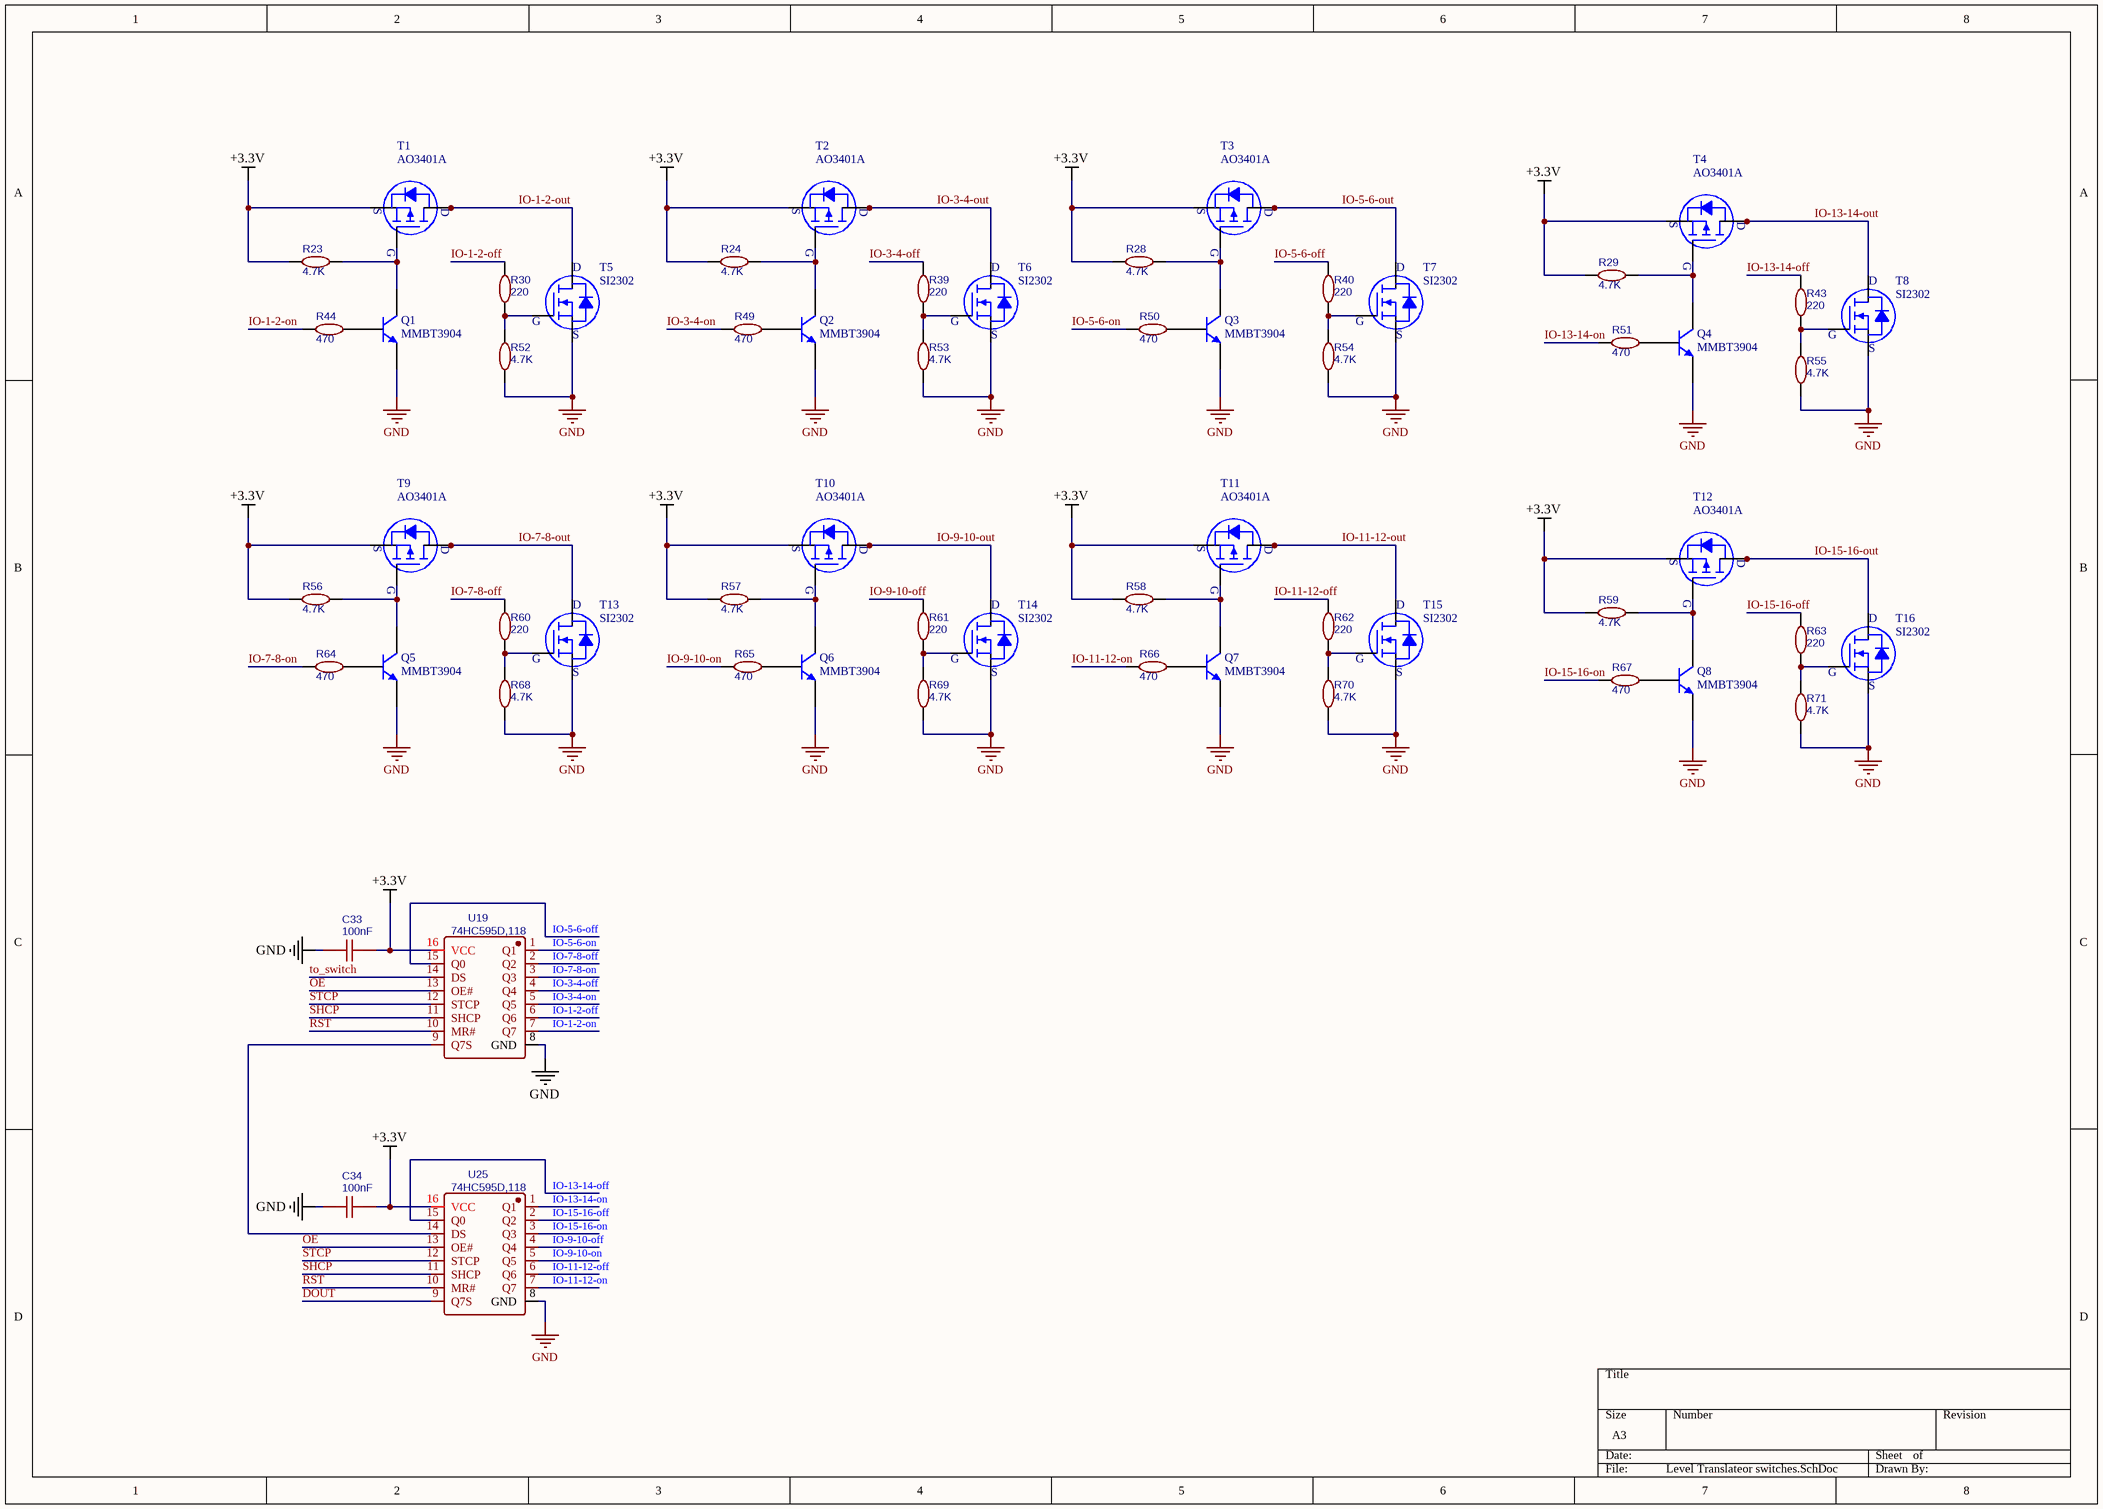
[diagram p5: Level Translateor switches.SchDoc]

### Parts
(Parts that share a designator on the sheet are numbered #1, #2 ... from top to bottom, then left to right.)
C33  100nF  [C0603]
C34  100nF  [C0603]
Q1  MMBT3904  [SOT-23-3]
Q2  MMBT3904  [SOT-23-3]
Q3  MMBT3904  [SOT-23-3]
Q4  MMBT3904  [SOT-23-3]
Q5  MMBT3904  [SOT-23-3]
Q6  MMBT3904  [SOT-23-3]
Q7  MMBT3904  [SOT-23-3]
Q8  MMBT3904  [SOT-23-3]
R23  4.7K  [R0603]
R24  4.7K  [R0603]
R28  4.7K  [R0603]
R29  4.7K  [R0603]
R30  220  [R0603]
R39  220  [R0603]
R40  220  [R0603]
R43  220  [R0603]
R44  470  [R0603]
R49  470  [R0603]
R50  470  [R0603]
R51  470  [R0603]
R52  4.7K  [R0603]
R53  4.7K  [R0603]
R54#2  4.7K  [R0603]
R55#2  4.7K  [R0603]
R56#2  4.7K  [R0603]
R57#2  4.7K  [R0603]
R58#2  4.7K  [R0603]
R59#2  4.7K  [R0603]
R60#2  220  [R0603]
R61#2  220  [R0603]
R62#2  220  [R0603]
R63#2  220  [R0603]
R64#2  470  [R0603]
R65#2  470  [R0603]
R66#2  470  [R0603]
R67#2  470  [R0603]
R68#2  4.7K  [R0603]
R69#2  4.7K  [R0603]
R70  4.7K  [R0603]
R71  4.7K  [R0603]
T1  AO3401A  [SOT-23-3]
T2  AO3401A  [SOT-23-3]
T3  AO3401A  [SOT-23-3]
T4  AO3401A  [SOT-23-3]
T5  SI2302  [SOT-23-3]
T6  SI2302  [SOT-23-3]
T7  SI2302  [SOT-23-3]
T8  SI2302  [SOT-23-3]
T9  AO3401A  [SOT-23-3]
T10  AO3401A  [SOT-23-3]
T11  AO3401A  [SOT-23-3]
T12  AO3401A  [SOT-23-3]
T13  SI2302  [SOT-23-3]
T14  SI2302  [SOT-23-3]
T15  SI2302  [SOT-23-3]
T16  SI2302  [SOT-23-3]
U19  74HC595D,118  [SOIC-16_L9.9-W3.9-P1.27-LS6.0-BL]
U25  74HC595D,118  [SOIC-16_L9.9-W3.9-P1.27-LS6.0-BL]

### Nets
+3.3V: C33.2 C34.2 R23.1 R24.1 R28.1 R29.1 R56#2.1 R57#2.1 R58#2.1 R59#2.1 T1.3(S) T2.3(S) T3.3(S) T4.3(S) T9.3(S) T10.3(S) T11.3(S) T12.3(S) U19.16(VCC) U25.16(VCC)
GND: C33.1 C34.1 Q1.3(E) Q2.3(E) Q3.3(E) Q4.3(E) Q5.3(E) Q6.3(E) Q7.3(E) Q8.3(E) R52.1 R53.1 R54#2.1 R55#2.1 R68#2.1 R69#2.1 R70.1 R71.1 T5.3(S) T6.3(S) T7.3(S) T8.3(S) T13.3(S) T14.3(S) T15.3(S) T16.3(S) U19.8(GND) U25.8(GND)
IO-1-2-out: T1.2(D) T5.2(D)
IO-3-4-out: T2.2(D) T6.2(D)
IO-5-6-out: T3.2(D) T7.2(D)
IO-7-8-out: T9.2(D) T13.2(D)
IO-9-10-out: T10.2(D) T14.2(D)
IO-11-12-out: T11.2(D) T15.2(D)
IO-13-14-out: T4.2(D) T8.2(D)
IO-15-16-out: T12.2(D) T16.2(D)
DOUT: U25.9(Q7S)
IO-1-2-off: R30.1 U19.6(Q6)
IO-1-2-on: R44.2 U19.7(Q7)
IO-3-4-off: R39.1 U19.4(Q4)
IO-3-4-on: R49.2 U19.5(Q5)
IO-5-6-off: R40.1 U19.15(Q0)
IO-5-6-on: R50.2 U19.1(Q1)
IO-7-8-off: R60#2.1 U19.2(Q2)
IO-7-8-on: R64#2.2 U19.3(Q3)
IO-9-10-off: R61#2.1 U25.4(Q4)
IO-9-10-on: R65#2.2 U25.5(Q5)
IO-11-12-off: R62#2.1 U25.6(Q6)
IO-11-12-on: R66#2.2 U25.7(Q7)
IO-13-14-off: R43.1 U25.15(Q0)
IO-13-14-on: R51.2 U25.1(Q1)
IO-15-16-off: R63#2.1 U25.2(Q2)
IO-15-16-on: R67#2.2 U25.3(Q3)
OE: U19.13(OE#) U25.13(OE#)
RST: U19.10(MR#) U25.10(MR#)
SHCP: U19.11(SHCP) U25.11(SHCP)
STCP: U19.12(STCP) U25.12(STCP)
to_switch: U19.14(DS)
NetQ1_1: Q1.1(B) R44.1
NetQ1_2: Q1.2(C) R23.2 T1.1(G)
NetQ2_1: Q2.1(B) R49.1
NetQ2_2: Q2.2(C) R24.2 T2.1(G)
NetQ3_1: Q3.1(B) R50.1
NetQ3_2: Q3.2(C) R28.2 T3.1(G)
NetQ4_1: Q4.1(B) R51.1
NetQ4_2: Q4.2(C) R29.2 T4.1(G)
NetQ5_1: Q5.1(B) R64#2.1
NetQ5_2: Q5.2(C) R56#2.2 T9.1(G)
NetQ6_1: Q6.1(B) R65#2.1
NetQ6_2: Q6.2(C) R57#2.2 T10.1(G)
NetQ7_1: Q7.1(B) R66#2.1
NetQ7_2: Q7.2(C) R58#2.2 T11.1(G)
NetQ8_1: Q8.1(B) R67#2.1
NetQ8_2: Q8.2(C) R59#2.2 T12.1(G)
NetR30_2: R30.2 R52.2 T5.1(G)
NetR39_2: R39.2 R53.2 T6.1(G)
NetR40_2: R40.2 R54#2.2 T7.1(G)
NetR43_2: R43.2 R55#2.2 T8.1(G)
NetR60#2_2: R60#2.2 R68#2.2 T13.1(G)
NetR61#2_2: R61#2.2 R69#2.2 T14.1(G)
NetR62#2_2: R62#2.2 R70.2 T15.1(G)
NetR63#2_2: R63#2.2 R71.2 T16.1(G)
NetU19_9: U19.9(Q7S) U25.14(DS)

### Notes on the sheet
- Title
- Size:
- Date:
- A3
- Number:
- Time:
- Revision:
- Sheet
- of
- File:

### Library data of the parts
C33 C34 = 100nF: as C43 on sheet Shift Registers; BOM_LCSC Assembly: Yes; spicePre: C; spiceSymbolName: CC0603KRX7R9BB104; Supplier: LCSC; Supplier Part Number: C14663
Q1-Q8 = MMBT3904: MMBT Series 40 V 200 mA SMT NPN Silicon General Purpose Transistor - SOT-23; Manufacturer: Changjiang Electronics Tech (CJ); LCSC Part Number: C20526; Supplier: LCSC; Manufacture Part Number: MMBT3904
R23 R24 R28 R29 R52 R53 R54#2 R55#2 R56#2 R57#2 R58#2 R59#2 R68#2 R69#2 R70 R71 = 1K: Manufacture Part Number: 0603WAF4701T5E; Manufacturer: Uniroyal Elec; nameAlias: Resistance (Ohms); Supplier: LCSC; Supplier Part Number: C23162; spicePre: R
R30 R39 R40 R43 R60#2 R61#2 R62#2 R63#2 = 1K: Manufacture Part Number: 0603WAF2200T5E; Manufacturer: Uniroyal Elec; nameAlias: Resistance (Ohms); Supplier: LCSC; Supplier Part Number: C22962; spicePre: R
R44 R49-R51 R64#2 R65#2 R66#2 R67#2 = 1K: Manufacture Part Number: 0603WAF4700T5E; Manufacturer: Uniroyal Elec; nameAlias: Resistance (Ohms); Supplier: LCSC; Supplier Part Number: C23179; spicePre: R
T1-T4 T9-T12 = AO3401A: Manufacturer: Alpha & Omega Semicon; LCSC Part Number: C15127; Manufacture Part Number: AO3401A
T5-T8 T13-T16 = SI2302: MOSFET N TRENCH 20V 2.1A 1.2V @ 50UA 72 M? @ 3.6A,4.5V SOT-23(SOT-23-3) ROHS; Manufacturer: Guangdong Hottech; LCSC Part Number: C181087; Manufacture Part Number: SI2302
U19 U25 = 74HC595D,118: Manufacturer: Nexperia; SMT Type: Basic; spicePre: X; BOM_LCSC Assembly: Yes; image: //image.lceda.cn/szlcsc/C5947.jpg; spiceSymbolName: 74HC595D,118; Supplier: LCSC; Manufacture Part Number: 74HC595D,118; Supplier Part Number: C5947

## Nets that join several sheets
+3.3V: FPGA (CN5.3), Shift Registers (C43.2 C44.2 U22.16 U24.16), Level Translators (24 pins), Logic Voltage Source (R6.2), Level Translateor switches (20 pins)
+12V: FPGA (CN5.4), Shift Registers (U21.10 U23.10), Level Translators (16 pins), Logic Voltage Source (C42.2 U20.1)
DUT_VH: Level Translators (32 pins), Logic Voltage Source (JP2.2)
GND: FPGA (17 pins), Shift Registers (6 pins), Level Translators (72 pins), Logic Voltage Source (7 pins), Level Translateor switches (28 pins)
IO-1-2-out: Level Translators (C3.2 U4.1), Level Translateor switches (T1.2 T5.2)
IO-3-4-out: Level Translators (C15.2 U10.1), Level Translateor switches (T2.2 T6.2)
IO-5-6-out: Level Translators (C5.2 U5.1), Level Translateor switches (T3.2 T7.2)
IO-7-8-out: Level Translators (C25.2 U15.1), Level Translateor switches (T9.2 T13.2)
IO-9-10-out: Level Translators (C27.2 U16.1), Level Translateor switches (T10.2 T14.2)
IO-11-12-out: Level Translators (C17.2 U11.1), Level Translateor switches (T11.2 T15.2)
IO-13-14-out: Level Translators (C13.2 U9.1), Level Translateor switches (T4.2 T8.2)
IO-15-16-out: Level Translators (C1.2 U3.1), Level Translateor switches (T12.2 T16.2)
DOUT: Shift Registers (CN4.5), Level Translateor switches (U25.9)
GPIO_01: FPGA (U2.04), Level Translators (U7.2)
GPIO_02: FPGA (U2.05), Level Translators (U4.3)
GPIO_03: FPGA (U2.06), Level Translators (U7.3)
GPIO_04: FPGA (U2.07), Level Translators (U4.2)
GPIO_06: FPGA (U2.09), Level Translators (U10.2)
GPIO_07: FPGA (U2.010), Level Translators (U10.3)
GPIO_08: FPGA (U2.013), Level Translators (U13.2)
GPIO_09: FPGA (U2.014), Level Translators (U13.3)
GPIO_010: FPGA (U2.015), Level Translators (U15.2)
GPIO_011: FPGA (U2.016), Level Translators (U15.3)
GPIO_012: FPGA (U2.017), Level Translators (U17.2)
GPIO_013: FPGA (U2.018), Level Translators (U17.3)
GPIO_014: FPGA (U2.019), Level Translators (U5.2)
GPIO_015: FPGA (U2.020), Level Translators (U5.3)
GPIO_016: FPGA (U2.021), Level Translators (U8.2)
GPIO_017: FPGA (U2.022), Level Translators (U8.3)
GPIO_018: FPGA (U2.023), Level Translators (U11.2)
GPIO_019: FPGA (U2.024), Level Translators (U11.3)
GPIO_020: FPGA (U2.025), Level Translators (U14.3)
GPIO_021: FPGA (U2.026), Level Translators (U14.2)
GPIO_022: FPGA (U2.027), Level Translators (U16.3)
GPIO_023: FPGA (U2.028), Level Translators (U16.2)
GPIO_024: FPGA (U2.031), Level Translators (U18.3)
GPIO_025: FPGA (U2.032), Level Translators (U18.2)
GPIO_026: FPGA (U2.033), Level Translators (U3.3)
GPIO_027: FPGA (U2.034), Level Translators (U3.2)
GPIO_028: FPGA (U2.035), Level Translators (U6.3)
GPIO_029: FPGA (U2.036), Level Translators (U6.2)
GPIO_030: FPGA (U2.037), Level Translators (U9.3)
GPIO_031: FPGA (U2.038), Level Translators (U9.2)
GPIO_032: FPGA (U2.039), Level Translators (U12.3)
GPIO_033: FPGA (U2.040), Level Translators (U12.2)
IO1: FPGA (P1.1), Level Translators (RLY1.3)
IO2: FPGA (P1.2), Level Translators (RLY2.3)
IO3: FPGA (P1.3), Level Translators (RLY3.3)
IO4: FPGA (P1.4), Level Translators (RLY4.3)
IO5: FPGA (P1.5), Level Translators (RLY8.3)
IO6: FPGA (P1.6), Level Translators (RLY7.3)
IO7: FPGA (P1.7), Level Translators (RLY6.3)
IO8: FPGA (P1.8), Level Translators (RLY5.3)
IO9: FPGA (P1.9), Level Translators (RLY12.3)
IO10: FPGA (P1.10), Level Translators (RLY11.3)
IO11: FPGA (P1.11), Level Translators (RLY10.3)
IO12: FPGA (P1.12), Level Translators (RLY9.3)
IO13: FPGA (P1.13), Level Translators (RLY16.3)
IO14: FPGA (P1.14), Level Translators (RLY15.3)
IO15: FPGA (P1.15), Level Translators (RLY14.3)
IO16: FPGA (P1.16), Level Translators (RLY13.3)
OE: Shift Registers (CN4.4 U22.13 U24.13), Level Translateor switches (U19.13 U25.13)
REL1: Shift Registers (U21.11), Level Translators (RLY1.1)
REL2: Shift Registers (U21.12), Level Translators (RLY2.1)
REL3: Shift Registers (U21.13), Level Translators (RLY3.1)
REL4: Shift Registers (U21.14), Level Translators (RLY4.1)
REL5: Shift Registers (U21.15), Level Translators (RLY8.1)
REL6: Shift Registers (U21.16), Level Translators (RLY7.1)
REL7: Shift Registers (U21.17), Level Translators (RLY6.1)
REL8: Shift Registers (U21.18), Level Translators (RLY5.1)
REL9: Shift Registers (U23.11), Level Translators (RLY12.1)
REL10: Shift Registers (U23.12), Level Translators (RLY11.1)
REL11: Shift Registers (U23.13), Level Translators (RLY10.1)
REL12: Shift Registers (U23.14), Level Translators (RLY9.1)
REL13: Shift Registers (U23.15), Level Translators (RLY16.1)
REL14: Shift Registers (U23.16), Level Translators (RLY15.1)
REL15: Shift Registers (U23.17), Level Translators (RLY14.1)
REL16: Shift Registers (U23.18), Level Translators (RLY13.1)
RST: Shift Registers (CN4.1 U22.10 U24.10), Level Translateor switches (U19.10 U25.10)
SHCP: Shift Registers (CN4.2 U22.11 U24.11), Level Translateor switches (U19.11 U25.11)
STCP: Shift Registers (CN4.3 U22.12 U24.12), Level Translateor switches (U19.12 U25.12)
to_switch: Shift Registers (U24.9), Level Translateor switches (U19.14)
VSET: FPGA (CN1.8), Logic Voltage Source (R11.2)